# Altium schematic sheet connectors.SchDoc
size A4
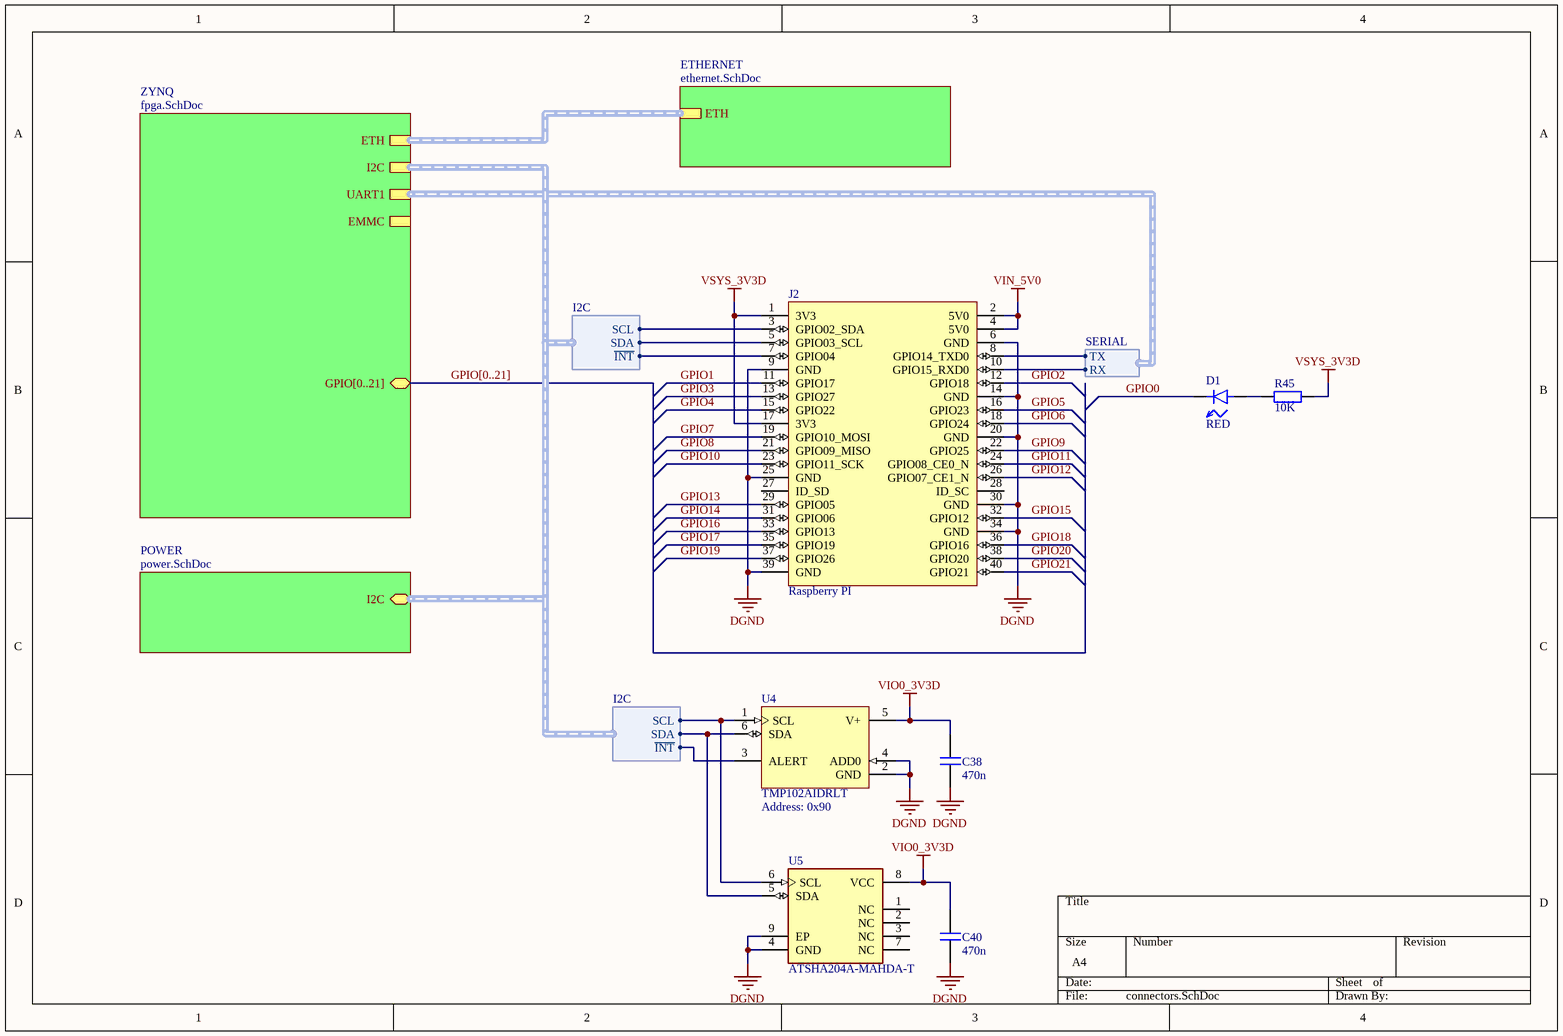
[diagram p0: connectors.SchDoc]

## Parts
C38  value 470n  [CAPC1608X08N]  (hidden comment: cap)
C40  value 470n  [CAPC1608X08N]  (hidden comment: cap)
D1  value RED  [CAPCP1005X06N]  (hidden comment: led)
J2  Raspberry PI  [raspi_male_con]
R45  value 10K  [RESC1005X04N]  (hidden comment: res)
U4  TMP102AIDRLT  Address: 0x90  [DRL0006A_L]
U5  ATSHA204A-MAHDA-T  [FP-C04-21355-Q4B-MFG]

## Sub-sheets
ETHERNET = ethernet.SchDoc: ETH (harness ETHERNET)
POWER = power.SchDoc: I2C (bidir, harness I2C)
ZYNQ = fpga.SchDoc: ETH (harness ETHERNET), I2C (harness I2C), EMMC (harness SDCARD), UART1 (harness SERIAL), GPIO[0..21] (bidir)

## Harnesses
I2C: SDA, SCL, ~{INT}
SERIAL: TX, RX

## Nets
DGND: C38.2 C40.2 J2.6(GND) J2.9(GND) J2.14(GND) J2.20(GND) J2.25(GND) J2.30(GND) J2.34(GND) J2.39(GND) U4.2(GND) U4.4(ADD0) U5.4(GND) U5.9(EP)
VIN_5V0: J2.2(5V0) J2.4(5V0)
VIO0_3V3D: C38.1 C40.1 U4.5(V+) U5.8(VCC)
VSYS_3V3D: J2.1(3V3) J2.17(3V3) R45.2
GPIO0: D1.C
GPIO1: J2.11(GPIO17)
GPIO2: J2.12(GPIO18)
GPIO3: J2.13(GPIO27)
GPIO4: J2.15(GPIO22)
GPIO5: J2.16(GPIO23)
GPIO6: J2.18(GPIO24)
GPIO7: J2.19(GPIO10_MOSI)
GPIO8: J2.21(GPIO09_MISO)
GPIO9: J2.22(GPIO25)
GPIO10: J2.23(GPIO11_SCK)
GPIO11: J2.24(GPIO08_CE0_N)
GPIO12: J2.26(GPIO07_CE1_N)
GPIO13: J2.29(GPIO05)
GPIO14: J2.31(GPIO06)
GPIO15: J2.32(GPIO12)
GPIO16: J2.33(GPIO13)
GPIO17: J2.35(GPIO19)
GPIO18: J2.36(GPIO16)
GPIO19: J2.37(GPIO26)
GPIO20: J2.38(GPIO20)
GPIO21: J2.40(GPIO21)
NetD1_A: D1.A R45.1
NetJ2_3: J2.3(GPIO02_SDA) U4.1(SCL) U5.6(SCL) ; sheet POWER/I2C.SCL
NetJ2_5: J2.5(GPIO03_SCL) U4.6(SDA) U5.5(SDA) ; sheet POWER/I2C.SDA
NetJ2_7: J2.7(GPIO04) U4.3(ALERT) ; sheet POWER/I2C.~{INT}
NetJ2_8: J2.8(GPIO14_TXD0) ; sheet ZYNQ/UART1.TX
NetJ2_10: J2.10(GPIO15_RXD0) ; sheet ZYNQ/UART1.RX

Not connected (* = marked no-connect by the designer): J2 27(ID_SD) 28(ID_SC); U5 1(NC) 2(NC) 3(NC) 7(NC)

## Buses and harness runs
bus GPIO[0..21] = sheet ZYNQ/GPIO[0..21]
harness sheet ETHERNET/ETH = sheet ZYNQ/ETH
harness sheet POWER/I2C = sheet ZYNQ/I2C

## Library data of the parts
C38 C40 = cap: Capacitor; voltage: *; type: *; #digikey: *; #mouser: *
D1 = led: pin to pad: A>1 C>2
J2 = raspberry_2x20_con: Raspberry PI 2x20 connector
R45 = res: Resistor; power: *; voltage: *; #digikey: *; #mouser: *
U4 = CMP-1685-00013-1: Low Power Digital Temperature Sensor with SMBus and Two-Wire Serial Interface, 1.4 to 3.6 V, -40 to 125 degC, 6-Pin SOT (DRL), Green (RoHS & no Sb/Br), Tape and Reel; ComponentLink3URL: http://www.ti.com/lit/ml/mpds159c/mpds159c.pdf; PackageVersion: 4205622-3/D, 08/2207; ComponentLink2Description: Datasheet; PackageReference: DRL0006A; ComponentLink2URL: http://www.ti.com/lit/ds/symlink/tmp102.pdf; ComponentLink3Description: Package Specification; ComponentLink1Description: Manufacturer URL; DatasheetVersion: SBOS397F, 12/2015; PackageDescription: 6-Pin Plastic Small Outline, Body 1.6 x 1.2 mm, Pitch 0.5 mm; ComponentLink1URL: http://www.ti.com/
U5 = CMP-06260-000005-1: IC AUTHENTICATION CHIP 8UDFN; Manufacturer: Microchip Technology; Standoff Height: 0mm; Description: Peripheral Controller Atmel Crypto EEPROM 8-Pin UDFN; Ambient Temperature Range High: +85°C; Ambient Temperature Range Low: -40°C; Octopart: https://octopart.com/atsha204a-mahda-t-microchip-77761815; Device Class L1: Integrated Circuits (ICs); Digikey Description: IC AUTHENTICATION CHIP 8UDFN; RoHS: TRUE; Device Class L3: unset; Temperature: -40°C to +85°C; Temperature Range High: +85°C; Height: 0.6mm; Device Class L2: unset; Category: IC; Automotive: No; Package: C04-21355-Q4B; Lead Free: Yes; ComponentLink2Description: Datasheet; Temperature Range Low: -40°C; ComponentLink2URL: http://ww1.microchip.com/downloads/en/DeviceDoc/ATSHA204A-Data-Sheet-40002025A.pdf; Manufacturer Part Number: ATSHA204A-MAHDA-T